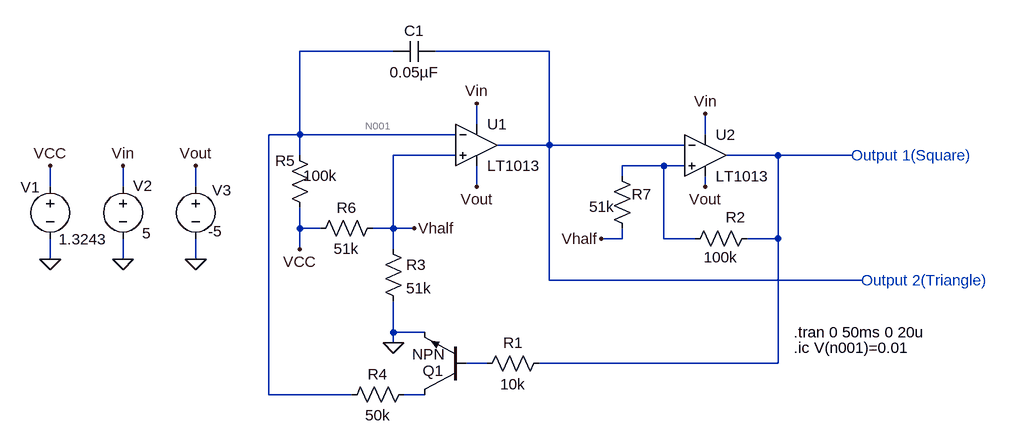
[diagram p0: schematic 260313-SynthesizerProject-VCO-V1.asc]
260313-SynthesizerProject-VCO-V1.asc, the LTspice schematic file:
Version 4.1
SHEET 1 1204 1368
WIRE -32 -192 -176 -192
WIRE 208 -192 32 -192
WIRE 96 -80 96 -112
WIRE -176 -64 -176 -192
WIRE -176 -64 -224 -64
WIRE 64 -64 -176 -64
WIRE 448 -64 448 -96
WIRE 208 -48 208 -192
WIRE 208 -48 128 -48
WIRE 416 -48 208 -48
WIRE -176 -32 -176 -64
WIRE 64 -32 -32 -32
WIRE 560 -32 480 -32
WIRE 672 -32 560 -32
WIRE 384 -16 320 -16
WIRE 416 -16 384 -16
WIRE 320 0 320 -16
WIRE -560 16 -560 -16
WIRE -448 16 -448 -16
WIRE -336 16 -336 -16
WIRE 96 16 96 -16
WIRE 448 16 448 0
WIRE -176 80 -176 48
WIRE -144 80 -176 80
WIRE -32 80 -32 -32
WIRE -32 80 -64 80
WIRE 0 80 -32 80
WIRE 320 96 320 80
WIRE 320 96 288 96
WIRE 384 96 384 -16
WIRE 432 96 384 96
WIRE 560 96 560 -32
WIRE 560 96 512 96
WIRE -176 112 -176 80
WIRE -32 112 -32 80
WIRE -560 128 -560 96
WIRE -448 128 -448 96
WIRE -336 128 -336 96
WIRE 208 160 208 -48
WIRE 688 160 208 160
WIRE -32 240 -32 192
WIRE 16 240 -32 240
WIRE -32 256 -32 240
WIRE 112 288 80 288
WIRE 560 288 560 96
WIRE 560 288 192 288
WIRE -224 336 -224 -64
WIRE -96 336 -224 336
WIRE 16 336 -16 336
FLAG -560 128 0
FLAG -448 128 0
FLAG -336 128 0
FLAG -448 -16 Vin
FLAG 96 -112 Vin
FLAG 448 -96 Vin
FLAG -336 -16 Vout
FLAG 96 16 Vout
FLAG 448 16 Vout
FLAG 0 80 Vhalf
FLAG 288 96 Vhalf
FLAG -560 -16 VCC
FLAG -176 112 VCC
FLAG -32 256 0
SYMBOL res 208 272 R90
WINDOW 0 0 56 VBottom 2
WINDOW 3 32 56 VTop 2
SYMATTR InstName R1
SYMATTR Value 10k
SYMBOL res 528 80 R90
WINDOW 0 -1 33 VBottom 2
WINDOW 3 29 56 VTop 2
SYMATTR InstName R2
SYMATTR Value 100k
SYMBOL res -48 96 R0
SYMATTR InstName R3
SYMATTR Value 51k
SYMBOL res 0 320 R90
WINDOW 0 0 56 VBottom 2
WINDOW 3 32 56 VTop 2
SYMATTR InstName R4
SYMATTR Value 50k
SYMBOL voltage -560 0 R0
WINDOW 0 -16 17 Right 2
WINDOW 3 87 97 Right 2
WINDOW 123 0 0 Left 0
WINDOW 39 0 0 Left 0
SYMATTR InstName V1
SYMATTR Value 1.3243
SYMBOL cap 32 -208 R90
WINDOW 0 0 32 VBottom 2
WINDOW 3 32 32 VTop 2
SYMATTR InstName C1
SYMATTR Value 0.05µF
SYMBOL res -192 -48 R0
WINDOW 0 -22 24 Left 2
WINDOW 3 21 47 Left 2
SYMATTR InstName R5
SYMATTR Value 100k
SYMBOL res -48 64 R90
WINDOW 0 0 56 VBottom 2
WINDOW 3 32 56 VTop 2
SYMATTR InstName R6
SYMATTR Value 51k
SYMBOL res 304 -16 R0
WINDOW 0 31 44 Left 2
WINDOW 3 -35 63 Left 2
SYMATTR InstName R7
SYMATTR Value 51k
SYMBOL npn 80 336 R180
WINDOW 0 35 37 Left 2
WINDOW 3 33 62 Left 2
SYMATTR InstName Q1
SYMBOL OpAmps\\LT1013 96 -112 R0
SYMATTR InstName U1
SYMBOL OpAmps\\LT1013 448 -96 R0
SYMATTR InstName U2
SYMBOL voltage -448 0 R0
WINDOW 0 30 -1 Top 2
WINDOW 3 36 103 Bottom 2
WINDOW 123 0 0 Left 0
WINDOW 39 0 0 Left 0
SYMATTR InstName V2
SYMATTR Value 5
SYMBOL voltage -336 0 R0
WINDOW 0 40 6 Top 2
WINDOW 3 30 100 Bottom 2
WINDOW 123 0 0 Left 0
WINDOW 39 0 0 Left 0
SYMATTR InstName V3
SYMATTR Value -5
TEXT 672 -32 Left 2 ;Output 1(Square)
TEXT 688 160 Left 2 ;Output 2(Triangle)
TEXT 584 240 Left 2 !.tran 0 50ms 0 20u
TEXT 584 264 Left 2 !.ic V(n001)=0.01

The netlist it stands for:
* 260313-SynthesizerProject-VCO-V1.asc
R1 N003 N005 10k
R2 N003 N004 100k
R3 Vhalf 0 51k
R4 N006 N001 50k
V1 VCC 0 1.3243
C1 N002 N001 0.05µF
R5 N001 VCC 100k
R6 Vhalf VCC 51k
R7 N004 Vhalf 51k
Q1 N006 N005 0 0 NPN
X§U1 Vhalf N001 Vin Vout N002 LT1013  ; pins In+ In- V+ V- OUT
X§U2 N004 N002 Vin Vout N003 LT1013  ; pins In+ In- V+ V- OUT
V2 Vin 0 5
V3 Vout 0 -5
.model NPN NPN
.model PNP PNP
.lib standard.bjt
* Output 1(Square)
* Output 2(Triangle)
.tran 0 50ms 0 20u
.ic V(n001)=0.01
.lib LTC.lib
.backanno
.end